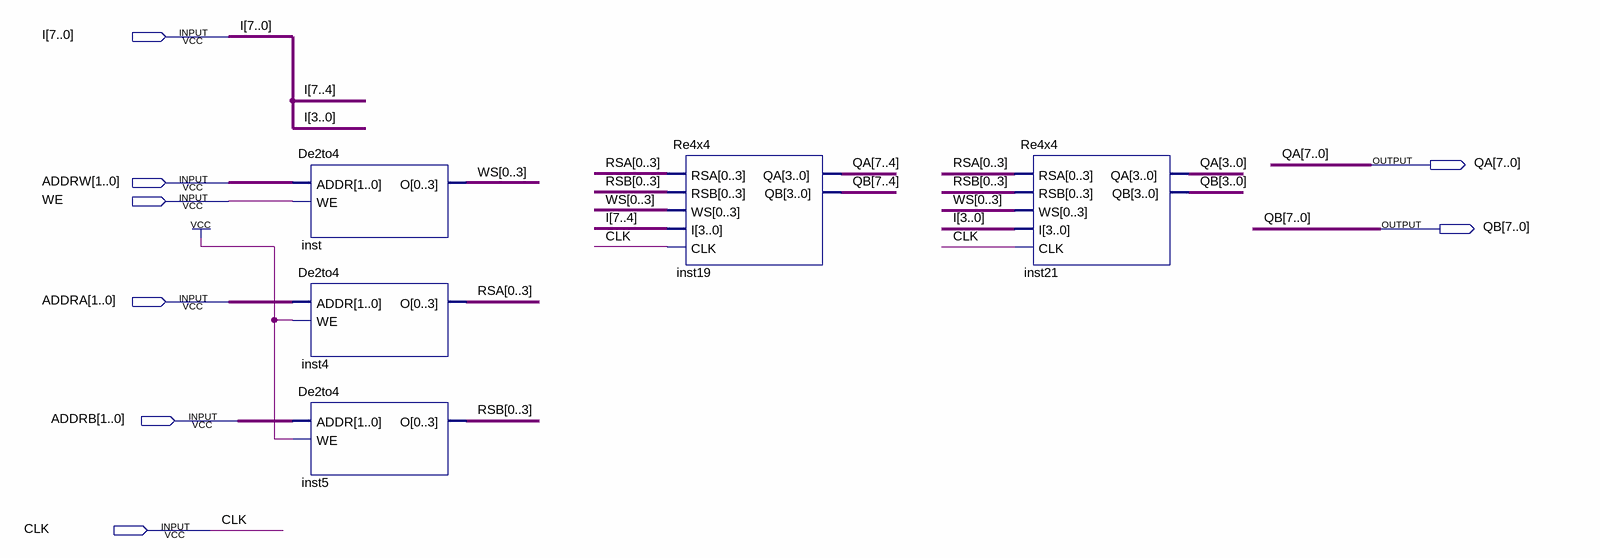
[diagram p0: schematic sheet]
// Quartus schematic REG4x8.bdf as structural Verilog: 5 symbols, 8 pins
module REG4x8 (
  input  [7:0] I,
  input  [1:0] ADDRW,
  input  WE,
  input  [1:0] ADDRA,
  input  [1:0] ADDRB,
  input  CLK,
  output [7:0] QA,
  output [7:0] QB
);

  wire [3:0] RSA, RSB, WS;

  De2to4 inst (.ADDR(ADDRW), .WE(WE), .O({WS[0], WS[1], WS[2], WS[3]}));
  De2to4 inst4 (.ADDR(ADDRA), .WE(1'b1), .O({RSA[0], RSA[1], RSA[2], RSA[3]}));
  De2to4 inst5 (.ADDR(ADDRB), .WE(1'b1), .O({RSB[0], RSB[1], RSB[2], RSB[3]}));
  Re4x4 inst19 (
    .RSA({RSA[0], RSA[1], RSA[2], RSA[3]}), .RSB({RSB[0], RSB[1], RSB[2], RSB[3]}),
    .WS({WS[0], WS[1], WS[2], WS[3]}), .I(I[7:4]), .CLK(CLK), .QA(QA[7:4]), .QB(QB[7:4]));
  Re4x4 inst21 (
    .RSA({RSA[0], RSA[1], RSA[2], RSA[3]}), .RSB({RSB[0], RSB[1], RSB[2], RSB[3]}),
    .WS({WS[0], WS[1], WS[2], WS[3]}), .I(I[3:0]), .CLK(CLK), .QA(QA[3:0]), .QB(QB[3:0]));
endmodule
